# EAGLE design wm8804 breakout (EAGLE 6.2)
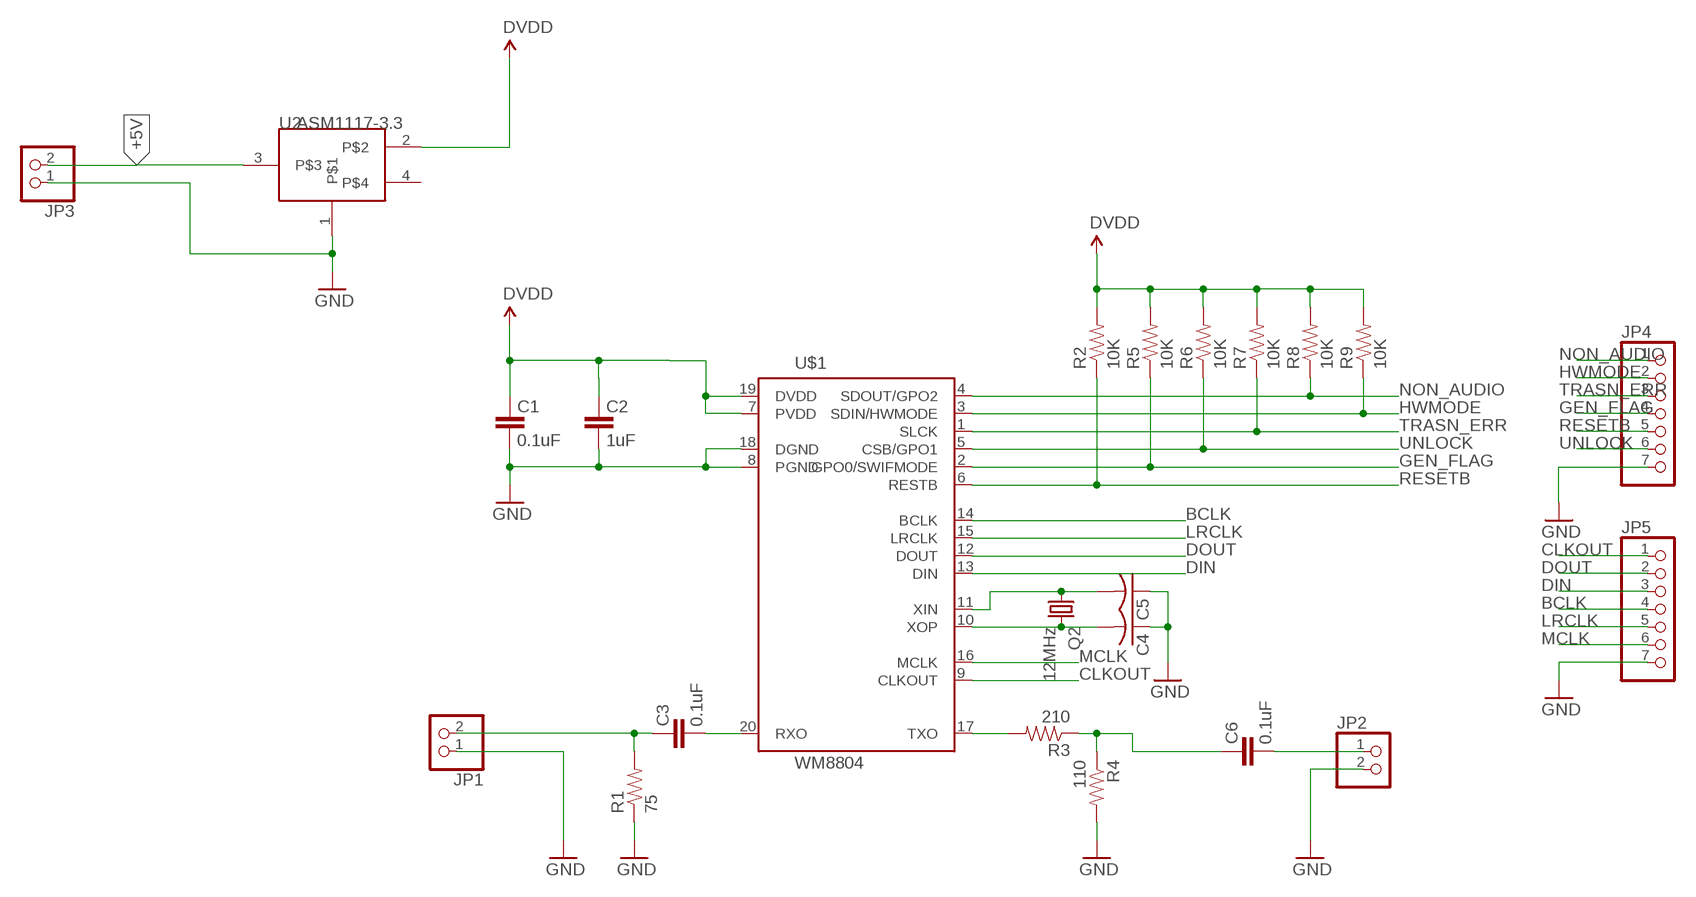
[diagram p0: schematic, sheet 1]

## Parts
C1  0.1uF  CAP0805  [0805]
C2  1uF  CAP0805  [0805]
C3  0.1uF  CAP0805  [0805]
C4  C-USC0805  [C0805]
C5  C-USC0805  [C0805]
C6  0.1uF  CAP0805  [0805]
JP1  PINHD-1X2  [1X02]
JP2  PINHD-1X2  [1X02]
JP3  PINHD-1X2  [1X02]
JP4  PINHD-1X7  [1X07]
JP5  PINHD-1X7  [1X07]
Q2  12MHz  CRYSTALCTS406  [CTS406]
R1  75  RESISTOR  [0805]
R2  10K  RESISTOR  [0805]
R3  210  RESISTOR  [0805]
R4  110  RESISTOR  [0805]
R5  10K  RESISTOR  [0805]
R6  10K  RESISTOR  [0805]
R7  10K  RESISTOR  [0805]
R8  10K  RESISTOR  [0805]
R9  10K  RESISTOR  [0805]
U2  ASM1117-3.3  [SOT223]
U$1  WM8804  [SSOP20]

## Nets
+5V: JP3.2 U2.3
BCLK: JP5.4 U$1.14(BCLK)
CLKOUT: JP5.1 U$1.9(CLKOUT)
DIN: JP5.3 U$1.13(DIN)
DOUT: JP5.2 U$1.12(DOUT)
DVDD: C1.2 C2.2 R2.2 R5.2 R6.2 R7.2 R8.2 R9.2 U2.2 U$1.7(PVDD) U$1.19(DVDD)
GEN_FLAG: JP4.4 R5.1 U$1.2(GPO0/SWIFMODE)
GND: C1.1 C2.1 C4.1 C5.1 JP1.1 JP2.2 JP3.1 JP4.7 JP5.7 R1.1 R4.2 U2.1 U$1.8(PGND) U$1.18(DGND)
HWMODE: JP4.2 R9.1 U$1.3(SDIN/HWMODE)
LRCLK: JP5.5 U$1.15(LRCLK)
MCLK: JP5.6 U$1.16(MCLK)
N$1: C5.2 Q2.1 U$1.11(XIN)
N$2: C4.2 Q2.3 U$1.10(XOP)
N$6: C3.2 JP1.2 R1.2
N$7: C3.1 U$1.20(RXO)
N$8: R3.2 U$1.17(TXO)
N$9: C6.2 R3.1 R4.1
N$10: C6.1 JP2.1
NON_AUDIO: JP4.1 R8.1 U$1.4(SDOUT/GPO2)
RESETB: JP4.5 R2.1 U$1.6(RESTB)
TRASN_ERR: JP4.3 R7.1 U$1.1(SLCK)
UNLOCK: JP4.6 R6.1 U$1.5(CSB/GPO1)
Unconnected: U2.4

## Library data of the parts
C1-C3 C6 = SparkFun:CAP: Capacitor Standard 0603 ceramic capacitor, and 0.1" leaded capacitor.
C4 C5 = rcl:C-US: CAPACITOR, American symbol
JP1-JP3 = pinhead:PINHD-1X2: PIN HEADER
JP4 JP5 = pinhead:PINHD-1X7: PIN HEADER
Q2 = crystal:CRYSTAL: CRYSTAL; OC_FARNELL: unknown; OC_NEWARK: unknown
R1-R9 = SparkFun:RESISTOR: Resistor Basic schematic elements and footprints for 0603, 1206, and PTH 1/10th watt (small) resistors.
U2 = Itead_IC_110429:ASM1117-3.3: ICP006
U$1 = wm8804:WM8804: TRANSCEIVER, S/PDIF, 1:1, 20SSOP Supply Voltage Range: 2.7V to 3.6V Logic Case Style: SSOP No. of Pins: 20 Operating Temperature Range: -40°C to +85°C SVHC: No SVHC (19-Dec-2011) Interface Type: Serial, 2 / 3 Wire Line / Bus Driver / Receiver / Transceiver Type: Digital Interface Transceiver with PLL No. of Channels: 2 Package / Case: SSOP Supply Current: 14.9mA Supply Voltage Max: 3.6V Supply Voltage Min: 2.7V Termination Type: SMD datasheet <http://roduino.ro/wp-content/uploads/2012/06/wm8804.pdf>

## Net classes
0 default: width 0.203 mm

## Board
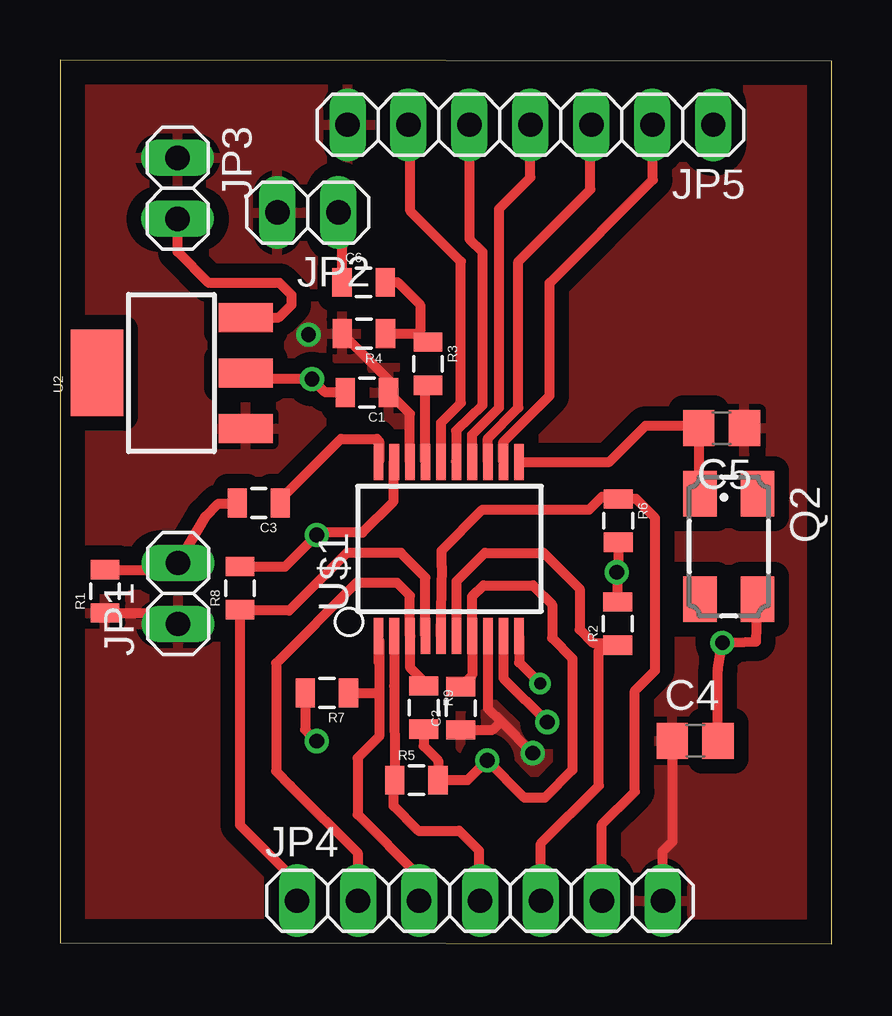
[diagram p1: board, top side]
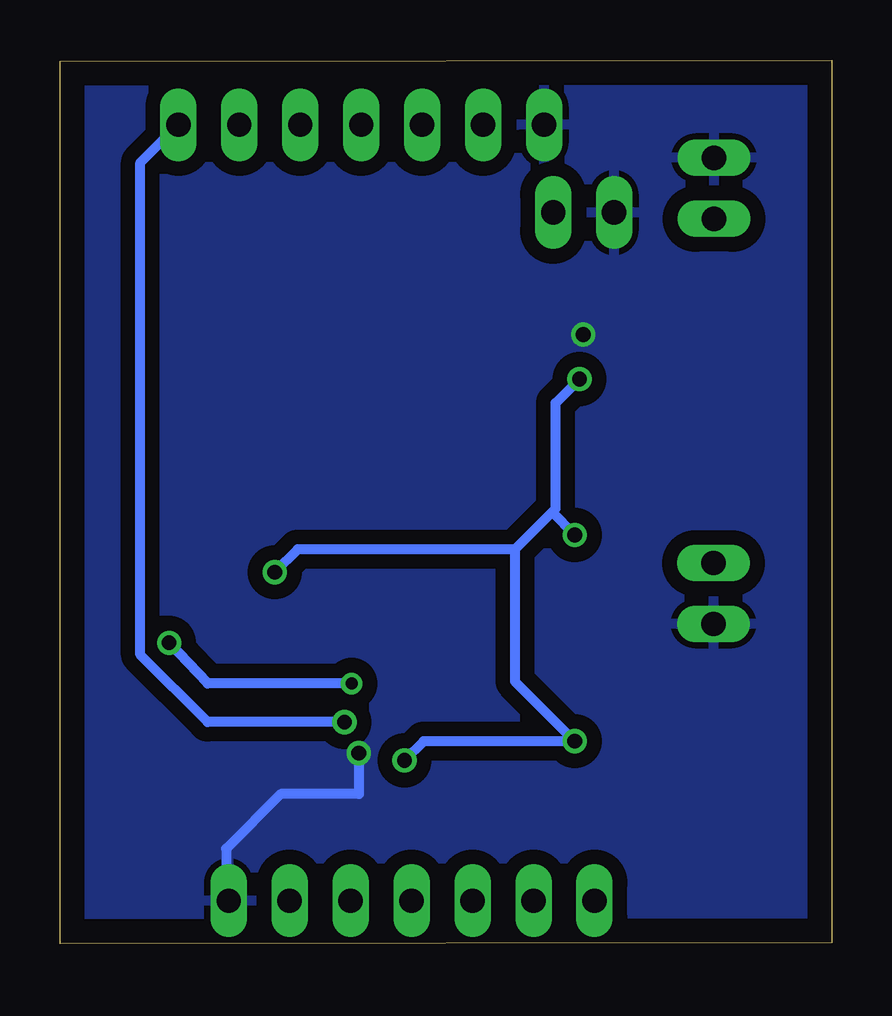
[diagram p2: board, bottom side, seen from below]

Size 32.15 x 36.85 mm. Coordinates in mm from the lower left corner, seen from the top.
Outline: 0,0.05 32.15,0 32.15,36.8 0,36.85 0,0.05
Copper layers (1*16): Top 0.035mm / dielectric 1.5mm / Bottom 0.035mm
Design rules: minimum track width 10mil, minimum drill 24mil, track to track 8mil, track to pad 8mil, pad to pad 8mil, via to via 8mil, smd to smd 8mil, copper to edge 40mil, drill to drill 8mil, minimum pad ring 10mil, minimum via ring 8mil, stop-mask expansion 4mil, vias tented up to drill 0mil, thermal gap 10mil

### Footprints (pad centres in the part's own frame; a part is rotated, then mirrored left to right if it is on the bottom)
0805 = smd 0.8 x 1.2: 1 -0.9,0; 2 0.9,0
C0805 = smd 1.3 x 1.5: 1 -0.95,0; 2 0.95,0
1X02 = drill 1.016 long: 1 -1.27,0; 2 1.27,0
1X07 = drill 1.016 long: 1 -7.62,0; 2 -5.08,0; 3 -2.54,0; 4 0,0; 5 2.54,0; 6 5.08,0; 7 7.62,0
CTS406 = smd 1.9 x 1.4: 1 -2.2,-1.2; 2 2.2,-1.2; 3 2.2,1.2; 4 -2.2,1.2
SOT223 = smd 1.219 x 2.235: 1 -2.311,-3.099; 2 0,-3.099; 3 2.311,-3.099 | smd 3.6 x 2.2: 4 0,3.099
SSOP20 = smd 0.4 x 1.5: 1 -2.955,-3.625; 2 -2.305,-3.625; 3 -1.655,-3.625; 4 -1.005,-3.625; 5 -0.355,-3.625; 6 0.295,-3.625; 7 0.945,-3.625; 8 1.595,-3.625; 9 2.245,-3.625; 10 2.895,-3.625; 11 2.895,3.625; 12 2.245,3.625; 13 1.595,3.625; 14 0.945,3.625; 15 0.295,3.625; 16 -0.355,3.625; 17 -1.005,3.625; 18 -1.655,3.625; 19 -2.305,3.625; 20 -2.955,3.625

### Placement (x,y rotation side)
C1  12.79,22.99 180 top
C2  16.7,9.83 90 top
C3  8.28,18.38 180 top
C4  26.47,8.47 0 top
C5  27.57,21.5 180 top
C6  12.65,27.58 0 top
JP1  4.92,14.61 90 top
JP2  10.33,30.49 180 top
JP3  4.9,31.5 270 top
JP4  17.5,1.8 0 top
JP5  19.6,34.15 180 top
Q2  27.87,16.57 270 top
R1  1.87,14.7 90 top
R2  23.24,13.35 90 top
R3  15.33,24.19 270 top
R4  12.66,25.44 180 top
R5  14.85,6.83 0 top
R6  23.26,17.65 270 top
R7  11.12,10.46 180 top
R8  7.5,14.83 90 top
R9  15.15,9.85 270 top
U2  4.64,23.8 90 top
U$1  16.23,16.47 0 top

### Tracks (layer width: path | path; a pad name or v marks a point on that pad's centre or on a via)
+5V
  Top 0.406: U2.3 9.11,26.11 9.65,26.65 9.65,27.05 9.15,27.55 6.2,27.55 4.9,28.85 JP3.2
BCLK
  Top 0.406: U$1.14 17.18,21.23 18.3,22.35 18.3,30.65 19.6,31.95 JP5.4
CLKOUT  (via drill 0.61)
  Top 0.406: U$1.9 18.48,11.08 v20.3,9.25
  Bottom 0.406: v20.3,9.25 26,9.25 28.8,12.05 28.8,32.57 JP5.1
DIN
  Top 0.406: U$1.13 17.82,21.07 19.1,22.35 19.1,28.45 22.1,31.45 22.1,34.11 JP5.3
DOUT
  Top 0.406: U$1.12 18.48,20.93 20.4,22.85 20.4,27.55 24.7,31.85 24.7,34.13 JP5.2
DVDD  (via drill 0.61)
  Top 0.406: R7.2 10.22,8.93 v10.7,8.45 | U2.2 8.79,23.55 v10.5,23.55 11.06,22.99 C1.2 | U$1.19 13.9,20.07 13.9,18.45 12.6,17.15 10.8,17.15 v10.7,17.05 9.88,16.23 9.38,15.73 R8.2 | C2.2 17.18,11.2 U$1.7 17.18,14.48 17.65,14.95 19.7,14.95 20.5,14.15 20.5,12.75 21.35,11.9 21.35,7.25 20.2,6.1 19.35,6.1 v17.8,7.65 16.98,6.83 R5.2 15.75,7.65 15.15,8.25 R9.2 | R2.2 23.24,15.46 v23.2,15.5 23.26,15.56 R6.2
  Bottom 0.406: v17.8,7.65 17,8.45 v10.7,8.45 13.2,10.95 13.2,16.45 | v10.5,23.55 11.5,22.55 11.5,18.15 11.65,18 | 13.2,16.45 11.65,18 | v10.7,17.05 11.65,18 | 13.2,16.45 22.25,16.45 v23.2,15.5
GEN_FLAG
  Top 0.406: U$1.2 13.93,10.75 R5.1 13.9,6.79 13.9,5.75 14.93,4.72 16.63,4.72 17.45,3.9 17.45,1.85 JP4.4
GND  (via drill 0.61)
  Top 0.406: C4.1 25.52,6.57 25.52,4.27 25.1,3.85 25.1,1.82 JP4.7 | U$1.8 17.82,9.83 18.38,9.28 | 18.38,9.28 v19.7,7.95 | U$1.18 14.57,22.11 C1.1 13.69,23.51 R4.2 | R1.1 4.46,13.8 JP1.1 | C2.1 18.03,8.93 18.38,9.28
  Bottom 0.406: v19.7,7.95 19.7,6.25 22.95,6.25 25.23,3.97 25.23,1.91 JP4.7
  other vias: 10.35,25.4
  pour Top (isolate 0.61): 0.2,36.75 32.15,36.7 32.15,0 0.2,0.05
  pour Bottom (isolate 0.61): 0.25,36.75 32.2,36.75 32.2,0 0.25,0
HWMODE
  Top 0.406: R9.1 15.15,10.95 14.6,11.5 14.6,12.82 U$1.3 14.57,14.53 14.05,15.05 12.35,15.05 9,11.7 9,7.2 9.6,6.6 12.4,3.8 12.4,1.82 JP4.2
LRCLK
  Top 0.406: JP5.5 17.06,29.39 17.6,28.85 17.6,22.45 16.5,21.4 16.5,20.12 U$1.15
MCLK
  Top 0.406: U$1.16 15.88,21.73 16.7,22.55 16.7,28.45 14.6,30.55 14.6,34.07 JP5.6
N$1
  Top 0.406: U$1.11 22.89,20.1 24.4,21.6 26.52,21.6 C5.2 26.62,18.82 Q2.1
N$2  (via drill 0.5, 0.6)
  Top 0.406: U$1.10 19.12,11.73 v20,10.85 | Q2.3 29,12.6 v27.6,12.55 27.42,11.43 C4.2
  Bottom 0.406: v20,10.85 26,10.85 v27.6,12.55
N$6
  Top 0.406: C3.2 7.35,18.35 6.6,18.35 6.07,17.82 JP1.2 4.64,15.6 R1.2
N$7
  Top 0.406: C3.1 9.18,18.53 11.7,21.05 13.2,21.05 13.3,20.95 13.3,20.12 U$1.20
N$8
  Top 0.406: U$1.17 15.22,23.19 R3.2
N$9
  Top 0.406: R4.1 14.9,25.44 | 14.9,25.44 14.98,25.44 R3.1 | C6.2 14.07,27.58 15,26.65 15,25.54 14.9,25.44
N$10
  Top 0.406: C6.1 11.75,30.34 JP2.1
NON_AUDIO
  Top 0.406: U$1.4 15.22,15.28 14.2,16.3 11.95,16.3 9.55,13.9 7.53,13.9 R8.1 7.5,4.95 9.88,2.57 JP4.1
RESETB
  Top 0.406: U$1.6 16.52,15.12 17.7,16.3 20.15,16.3 21.65,14.8 21.65,13.1 22.2,12.55 22.75,12.55 | 22.75,12.55 23.14,12.55 R2.1 | JP4.5 20.04,4.19 22.45,6.6 22.45,12.25 22.75,12.55
TRASN_ERR
  Top 0.406: 13.3,12.66 13.3,11.75 | 13.3,11.75 13.28,11.75 U$1.1 | 13.3,11.75 13.3,10.55 | 13.3,10.55 13.3,8.65 12.4,7.75 12.4,5.4 14.95,2.85 JP4.3 | R7.1 13.21,10.46 13.3,10.55
UNLOCK
  Top 0.406: U$1.5 15.85,12.87 15.9,15.75 15.9,16.4 17.6,18.1 22.05,18.1 22.58,18.63 R6.1 24,18.55 24.8,17.75 24.8,11.4 23.95,10.55 23.95,6.35 22.58,4.98 JP4.6